# Altium schematic sheet Sheet4.SchDoc
size A; SheetNumber: 1; SheetTotal: 1
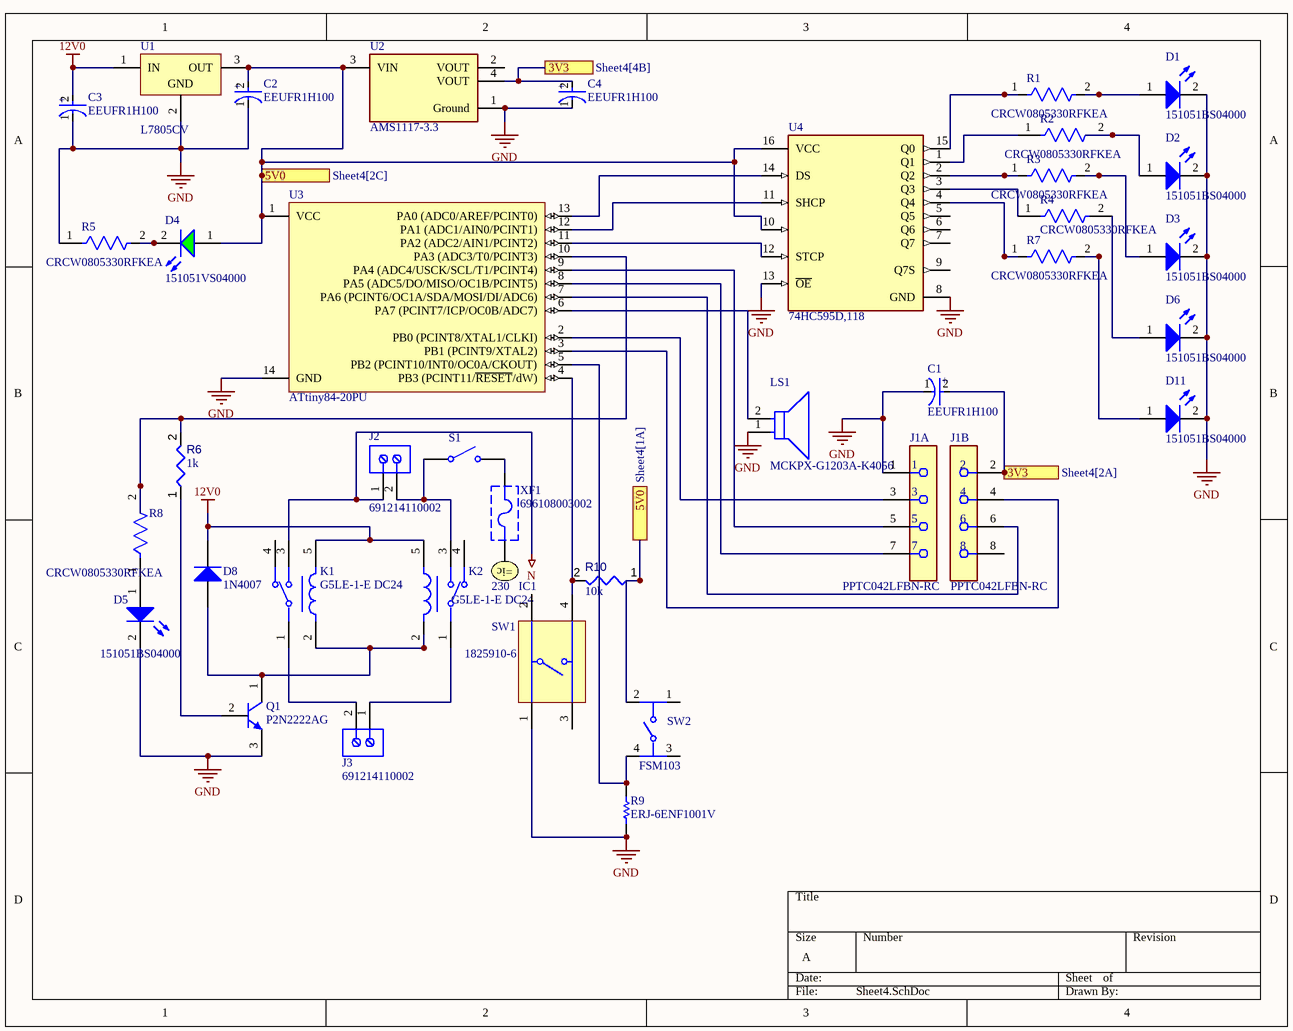
[diagram p0: Sheet4.SchDoc]

## Parts
C1  EEUFR1H100  [FP-RAD-TH-D_5_0_5-L_11_1-MFG]
C2  EEUFR1H100  [FP-RAD-TH-D_5_0_5-L_11_1-MFG]
C3  EEUFR1H100  [FP-RAD-TH-D_5_0_5-L_11_1-MFG]
C4  EEUFR1H100  [FP-RAD-TH-D_5_0_5-L_11_1-MFG]
D1  151051BS04000  [WL-TMRC_D5.9H8.7]
D2  151051BS04000  [WL-TMRC_D5.9H8.7]
D3  151051BS04000  [WL-TMRC_D5.9H8.7]
D4  151051VS04000  [WL-TMRC_D5.9H8.7]
D5  151051BS04000  [WL-TMRC_D5.9H8.7]
D6  151051BS04000  [WL-TMRC_D5.9H8.7]
D8  1N4007  [FAIR-DO-41-2]
D11  151051BS04000  [WL-TMRC_D5.9H8.7]
IC1  Initial Voltage: 230  (hidden comment: Initial Condition)
J1  PPTC042LFBN-RC  [FP-PPTC042LFBN-RC-MFG]  (parts A,B of 2)
J2  691214110002  [691214110002]
J3  691214110002  [691214110002]
K1  G5LE-1-E DC24  [FP-G5LE-1-E_DC24-MFG]
K2  G5LE-1-E DC24  [FP-G5LE-1-E_DC24-MFG]
LS1  MCKPX-G1203A-K4056  [FP-MCKPX-G1203A-K4056-MFG]
Q1  P2N2222AG  [ONSC-TO-92-3-29-11]
R1  CRCW0805330RFKEA  [FP-CRCW0805-e3-MFG]
R2  CRCW0805330RFKEA  [FP-CRCW0805-e3-MFG]
R3  CRCW0805330RFKEA  [FP-CRCW0805-e3-MFG]
R4  CRCW0805330RFKEA  [FP-CRCW0805-e3-MFG]
R5  CRCW0805330RFKEA  [FP-CRCW0805-e3-MFG]
R6  value 1k  [RESA60-630X240]  (hidden comment: MFR-25FBF52-47K5)
R7  CRCW0805330RFKEA  [FP-CRCW0805-e3-MFG]
R8  CRCW0805330RFKEA  [FP-CRCW0805-e3-MFG]
R9  ERJ-6ENF1001V  [RESC2013X70X40ML20T20]
R10  value 10k  [RESA60-630X240]  (hidden comment: MFR-25FBF52-47K5)
S1  Single-Pole, Single-Throw Switch  (value not drawn)
SW1  1825910-6  [TECO-1825910-6_V]
SW2  FSM103  [FP-FSM103-MFG]
U1  L7805CV  [TO220]
U2  AMS1117-3.3  [FP-AMS1117-IPC_C]
U3  ATtiny84-20PU  [14P3]
U4  74HC595D,118  [FP-SOT109-1-IPC_B]
XF1  696108003002  [696108003002]

## Ports
3V3 (see Sheet4[2A]), 3V3 (see Sheet4[4B]), 5V0 (see Sheet4[1A]), 5V0 (see Sheet4[2C])

## Nets
12V0: C3.2(A) D8.1(K) K1.5 K2.5 U1.1(IN)
GND: C1.1(C) C2.1(C) C3.1(C) C4.1(C) D1.2(K) D2.2(K) D3.2(K) D5.2(K) D6.2(K) D11.2(K) J1.1 LS1.1(C) Q1.3(E) R5.1 R9.1 SW1.1 U1.2(GND) U2.1(Ground) U3.14(GND) U4.8(GND) U4.13(~{OE})
N: J2.1 K1.3
3V3: C1.2(A) C4.2(A) J1.2 U2.4(VOUT) ; port 3V3
5V0: C2.2(A) D4.1(A) R10.1 SW2.2 U1.3(OUT) U2.3(VIN) U3.1(VCC) U4.10(~{MR}) U4.16(VCC) ; port 5V0
NetD1_1: D1.1(A) R1.2
NetD2_1: D2.1(A) R2.2
NetD3_1: D3.1(A) R3.2
NetD4_2: D4.2(K) R5.2
NetD5_1: D5.1(A) R8.1
NetD6_1: D6.1(A) R4.2
NetD8_2: D8.2(A) K1.2 K2.2 Q1.1(C)
NetD11_1: D11.1(A) R7.2
NetIC1_1: IC1.1 XF1.1
NetJ1_3: J1.3 U3.2(PB0_(PCINT8/XTAL1/CLKI))
NetJ1_4: J1.4 U3.3(PB1_(PCINT9/XTAL2))
NetJ1_5: J1.5 U3.9(PA4_(ADC4/USCK/SCL/T1/PCINT4))
NetJ1_6: J1.6 U3.7(PA6_(PCINT6/OC1A/SDA/MOSI/DI/ADC6))
NetJ1_7: J1.7 U3.8(PA5_(ADC5/DO/MISO/OC1B/PCINT5))
NetJ2_2: J2.2 K2.3 S1.1
NetJ3_1: J3.1 K2.1
NetJ3_2: J3.2 K1.1
NetLS1_2: LS1.2(A) U3.6(PA7_(PCINT7/ICP/OC0B/ADC7))
NetQ1_2: Q1.2(B) R6.1
NetR1_1: R1.1 U4.15(Q0)
NetR2_1: R2.1 U4.1(Q1)
NetR3_1: R3.1 U4.2(Q2)
NetR4_1: R4.1 U4.3(Q3)
NetR6_2: R6.2 R8.2 U3.10(PA3_(ADC3/T0/PCINT3))
NetR7_1: R7.1 U4.4(Q4)
NetR9_2: R9.2 SW2.4 U3.5(PB2_(PCINT10/INT0/OC0A/CKOUT))
NetR10_2: R10.2 SW1.4 U3.4(PB3_(PCINT11/~{RESET}/dW))
NetS1_2: S1.2 XF1.2
NetU3_11: U3.11(PA2_(ADC2/AIN1/PCINT2)) U4.12(STCP)
NetU3_12: U3.12(PA1_(ADC1/AIN0/PCINT1)) U4.11(SHCP)
NetU3_13: U3.13(PA0_(ADC0/AREF/PCINT0)) U4.14(DS)

Not connected (* = marked no-connect by the designer): J1 8; K1 4; K2 4; SW1 2 3; SW2 1 3; U2 2(VOUT); U4 5(Q5) 6(Q6) 7(Q7) 9(Q7S)

## Notes on the sheet
- (in symbol CMP-05427-001295-1) +

## Library data of the parts
C1-C4 = CMP-05427-001295-1: Aluminum Electrolytic Capacitors (Radial Lead Type) 10uF ±20% 50V; Lead Diameter: 0.5mm; Life (Hours): 5000Hour; Impedance: 340mR; Ripple Current (AC): 250mA; REACH SVHC: Yes; Tolerance: 20%; Construction: RADIAL; Min Operating Temperature: -40°C; Termination: Radial; Voltage Rating: 50V; Height: 11mm; Max Operating Temperature: 105°C; Capacitance: 10uF; Voltage: 50V; Diameter: 5mm; Lead Pitch: 2mm; Series: FR Radial; RoHS Compliant: Yes; Case/Package: Radial
D1-D3 D5 D6 D11 = CMP-1488-00009-2: NexarPartId: 29717812; Test Current: 20mA; Forward Voltage: 3.2V; Wavelength: 470nm; Lens Size: 5mm; Lens Style: Circular, Diffused, Round; Forward Current: 100mA; Peak Wavelength: 465nm; Viewing Angle: 40°; Luminous Intensity: 500mcd; Max Reverse Voltage (DC): 5V; Color: Blue; Case/Package: Radial; Width: 5mm; Mount: Through Hole; Min Operating Temperature: -40°C; Length: 5mm; Height: 8.6mm; Max Operating Temperature: 85°C; Packaging: Bulk; RoHS: Compliant; REACH SVHC: Unknown; Dominant Wavelength: 470nm
D4 = CMP-1488-00007-2: NexarPartId: 29717814; Forward Voltage: 2.1V; Viewing Angle: 40°; Lens Size: 5mm; Luminous Intensity: 140mcd; Color: Green; Max Reverse Voltage (DC): 5V; Wavelength: 572nm; Forward Current: 100mA; Peak Wavelength: 573nm; Test Current: 20mA; Lens Style: Circular, Diffused, Round; REACH SVHC: Unknown; Height: 8.6mm; Mount: Through Hole; Width: 5mm; Length: 5mm; Min Operating Temperature: -40°C; RoHS: Compliant; Dominant Wavelength: 572nm; Case/Package: Radial; Max Operating Temperature: 85°C; Packaging: Bulk
D8 = CMP-004-00007-2: General Purpose Rectifier, 1.1 V, 1.0 A, -55 to 175 degC, 2-Pin DO-41, RoHS, Tape and Reel; Manufacturer: Fairchild; Peak Reverse Current: 5uA; Max Surge Current: 30A; Elements: 1; Forward Voltage: 1.1V; Package Version: Rev. 2, 09/2008; Forward Current: 1A; Package Quantity: 5000; Packaging: TapeandReel; Package URL: http://www.fairchildsemi.com/dwg/DO/DO41A.pdf; Manufacturer URL: https://www.fairchildsemi.com/; Package Reference: DO-41-2; Pins: 2; Min Operating Temperature: -55°C; Datasheet Version: Rev. 1.1.0, 11/2014; Max Operating Temperature: 175°C; RoHS Compliant: True; Case/Package: DO-41-2; Mounting Technology: TH; Package Description: 2-Pin Axial Lead, Dia 2.375 mm, Body Length 4.63 mm; Datasheet URL: https://www.fairchildsemi.com/datasheets/1N/1N4007.pdf
IC1 = .IC: SimulationGenericComponent: True
J1 = CMP-25680-000004-1: CONN HDR 8POS 0.1 TIN PCB; Manufacturer: Sullins; Is Female: yes; Conn Orientation: Straight; Conn Gender: Female; Number Of Contacts: 8; Pitch: 2.54mm; Voltage Rating: 250V; Current Rating: 3A; Package: PPTC042LFBN-RC; Number Of Rows: 2; Manufacturer Part Number: PPTC042LFBN-RC; Contact Material: Tin,Nickel; Temperature: -40°C to +105°C; Height: 8.65mm; Device Class L2: Headers and Wire Housings; Octopart: https://octopart.com/pptc042lfbn-rc-sullins-271088; RoHS: TRUE; ComponentLink2URL: https://drawings-pdf.s3.amazonaws.com/10492.pdf; Lead Free: Yes; Automotive: No; Device Class L3: unset; ComponentLink2Description: Datasheet; Temperature Range High: +105°C; Digikey Description: CONN HDR 8POS 0.1 TIN PCB; Category: Conn; Device Class L1: Connectors; Temperature Range Low: -40°C
J2 J3 = CMP-1502-02464-2: NexarPartId: 18818288; Plating: Brass, Steel; Current: 10A; Pitch: 3.5052mm; Number of Levels: 1; Number of Contacts: 2; Wire Gauge (Min): 16AWG; Voltage: 300V; Wire Gauge (Max): 24AWG; Stripping Length: -6mm; Number of Pins: 2; Number of Rows: 1; REACH SVHC: Unknown; RoHS: Compliant; Housing Material: Nylon; Termination: Screw; Mount: Through Hole; Contact Plating: Brass, Tin; Number of Positions Per Level: 2; Color: Blue, Green; Width: 7.9mm; Voltage Rating: 300V; Length: 7.4mm; Current Rating: 10A; Wire/Cable Gauge: 24AWG; Packaging: Box; Max Operating Temperature: 105°C; Lead Pitch: 3.5mm; Height: 8.7mm; Contact Material: Brass; Min Operating Temperature: -40°C
K1 K2 = CMP-08822-000256-1: RELAY GEN PURPOSE SPDT 16A 24V; Release Time: 5ms; Application(s): POWER; Coil Resistance: 1.44kR; Power Consumption: 400mW; Max Voltage Rating (AC): 250V; Coil Current: 16.7mA; Life (Hours): 1000000Hour; Operate Time: 10ms; Coil Type: Non-Latching; Relay Type: General Purpose; Max Operating Temperature: 85°C; Radiation Hardening: No; Package Quantity: 500; Packaging: Tray; Lead Free: Lead Free; Depth: 16.5mm; Throw Configuration: SPDT; Contact Current Rating: 16A; Mount: Through Hole; Termination: PC Pin; Min Operating Temperature: -40°C; Height: 19mm; Coil Power: 400mW; Contact Material: Tin; Series: G5LE-E; Length: 22.5mm; Width: 16.5mm; Coil Voltage (DC): 24V; Max Current Rating: 16A; Number of Pins: 5
LS1 = CMP-12433-000001-1: MAGNETIC BUZZER AND TRANSDUCER - More Details; Manufacturer: Multicomp Pro; Operating Supply Voltage: 3V; Current: 30mA; Frequency: 2300Hz; Max Supply Voltage: 5V; Min Supply Voltage: 2V; Standoff Height: 0.5mm; ComponentLink2Description: Datasheet; ComponentLink2URL: http://www.farnell.com/datasheets/1498149.pdf?_ga=2.17855225.1157923166.1572356775-536200964.1569240579; Manufacturer Part Number: MCKPX-G1203A-K4056; Temperature Range High: +70°C; Device Class L2: Audio Products; Temperature Range Low: -20°C; Package: 0; Temperature: -20°C to +70°C; Category: Speak; Octopart: https://octopart.com/mckpx-g1203a-k4056-multicomp-12157154; RoHS: TRUE; Lead Free: Yes; Height: 9.5mm; Device Class L1: Electromechanical; Automotive: No; Device Class L3: Buzzers
Q1 = CMP-1048-01402-1: Amplifier Transistor, NPN Silicon, 3-Pin TO-92, Pb-Free, Bulk Box; Manufacturer: On Semiconductor; IC Continuous (A): 0.6; fT Min (MHz): 300; ComponentLink2Description: Datasheet; ComponentLink1Description: Manufacturer URL; ComponentLink2URL: http://www.onsemi.com/pub_link/Collateral/P2N2222A-D.PDF; ComponentLink3Description: Package Specification; RoHS: TRUE; ComponentLink1URL: http://www.onsemi.com/; PartNumber: P2N2222AG; Mounting Technology: Through Hole; PackageReference: TO-92-3-29-11_AM_SL; Polarity: NPN; Packing: Bulk Box; DatasheetVersion: Rev. 7; PackageDescription: 3-Pin Transistor Outline, Body 4.825 x 3.685 mm, Pitch 1.27 mm; PackageVersion: Rev. AM; ComponentLink3URL: http://www.onsemi.cn/pub_link/Collateral/2N6426-D.PDF
R1-R5 R7 R8 = CMP-2001-03823-2: RES Thick Film, 330Ω, 1%, 0.125W, 100ppm/°C, 0805; Voltage Rating (DC): 150V; Resistance: 330R; Max Power Dissipation: 125mW; Mount: Surface Mount; Packaging: Tape and Reel; Min Operating Temperature: -55°C; Military Standard: Not; Case Code (Metric): 2012; Height: 0.02inch; Voltage Rating: 150V; Case/Package: 0805; Max Operating Temperature: 155°C; Width: 0.049inch; Case Code (Imperial): 0805; Termination: SMD/SMT; Lead Free: Lead Free; Contact Plating: Tin; Package Quantity: 10; Composition: Thick Film; Length: 2mm; Features: Automotive AEC-Q200; Depth: 1.25mm; Weight: 0.000194oz; Tolerance: 1%; Power Rating: 125mW; Number of Terminations: 2; Temperature Coefficient: 100ppm/°C
R6 R10 = CMP-009-00057-4: Axial Resistor, 47.5 KOhm, +/- 1%, 0.25 W, -55 to 155 degC, 2-Pin THD, RoHS, Bulk; Manufacturer: Yageo; Voltage Rating: 250V; Power: 250mW; RoHS Compliant: True; Packaging: Bulk; Manufacturer URL: http://www.yageo.com/; Package Quantity: 200; Datasheet URL: http://www.yageo.com/documents/recent/Yageo%20LR_MFR_2013.pdf; Case/Package: Axial; Package Reference: MFR-25; Tolerance: 1%; Max Operating Temperature: 155°C; Package Description: 2-Pin Axial Lead, Dia 2.4 mm, Body Length 6.3 mm; Datasheet Version: Apr-13; Min Operating Temperature: -55°C; Mounting Technology: TH
R9 = CMP-2001-04375-5: Chip Resistor, 1 KOhm, +/- 1%, 0.125 W, -55 to 155 degC, 0805 (2012 Metric), RoHS, Tape and Reel; Manufacturer: Panasonic; Voltage Rating: 150 V; ComponentLink1URL: http://www.panasonic.com/; ComponentLink2Description: Datasheet; REACH SVHC: Yes; ComponentLink1Description: Manufacturer URL; Length: 2 mm; Height: 0.6 mm; Package Quantity: 1; PackageDescription: 2-Pin Surface Mount Device, Body 2 x 1.25 mm; Packaging: Cut Tape; PackageReference: 0805; Max Operating Temperature: 155 degC; Mounting Technology: Surface Mount; ComponentLink2URL: http://industrial.panasonic.com/cdbs/www-data/pdf/RDA0000/AOA0000C86.pdf; DatasheetVersion: 04/2015; Min Operating Temperature: -55 degC; RoHSCompliant: true; Mount: Surface Mount
S1 = SPST SW: closed: 0; Rclosed: 1m; Ropen: 1Meg; SimulationGenericComponent: True
SW1 = CMP-1684-00021-1: Tact Switch, SPST-NO, 0.05 A, -35 to 85 degC, 4-Pin THD, RoHS, Bulk; Manufacturer: TE Connectivity; Maximum Contact Resistance: 100mOhm; Mechanical Life: 100000Cycles; Bushing Type: Unthreaded; Switch Configuration: OFF(ON); Maximum DC Voltage Rating: 24V; Contact Rating @ Voltage: 0.05A@24VDC; Actuator Color: Black; Body Orientation: Straight; Function: MomentaryContact; Illumination: N/R; Actuator Style: RoundButton; Actuator Material: PolybutyleneTerephthalate; Dielectric Strength: 500VAC; Pole Throw Configuration: SPST; Actuator Length: 1.4mm; Product Weight: N/A; Contact Material: CopperAlloy; Housing Material: N/A; Terminal Type: PCPins; Minimum Insulation Resistance: 100MOhm; Package Description: 4-Pin Through Hole Device, Body 5.99 x 5.99 mm, Pitch 6.5 mm; Part No: 1825910-6; Package Reference: THD; Base Material: N/A; Manufacturer URL: http://www.te.com; Contact Plating: Silver; RoHS: Yes; Datasheet Version: Rev. C9; Electrical Life: 100000Cycles; Maximum AC Voltage Rating: N/A; Thread Size: N/R; Operating Temperature: -35to85C; Mounting: ThroughHole; Dimension: 5.99x5mm; Datasheet URL: http://www.te.com/commerce/DocumentDelivery/DDEController?Action=showdoc&DocId=Customer+Drawing%7F1825910%7FC9%7Fpdf%7FEnglish%7FENG_CD_1825910_C9.pdf%7F1825910-6; Family: 1825910; Seal Location: N/A; Seal Description: N/A; Packaging: N/A
SW2 = CMP-03407-000037-1: SWITCH TACTILE SPST-NO 0.05A 24V; Contact Resistance: 100mR; Actuator Length: 3.4mm; Switch Function: Off-Mom; Operating Force: 1.57N; Illumination Type: Non-Illuminated; Voltage Rating (DC): 12V; Current Rating: 50mA; Actuator Material: Polyester; Switch Travel: 0.3mm; Throw Configuration: SPST; Actuator Color: Black; Mechanical Life: 100000Cycles; Depth: 14.1mm; RoHS Compliant: Yes; Max Operating Temperature: 85°C; Mount: Through Hole; Min Operating Temperature: -35°C; Contact Plating: Silver; Width: 12mm; Package Quantity: 400; Radiation Hardening: No; Series: FSM100 ~ 104; Type: Switch; Termination: PC Pins; Voltage Rating: 24V; Contact Material: Brass; Max Voltage Rating (DC): 12V; Contact Current Rating: 50mA; Length: 12mm; Packaging: Loose Piece; Orientation: Straight; Max Current Rating: 50mA; Electrical Life: 100000Cycles
U1 = CMP-0244-00483-1: Positive Voltage Regulator, 5V, 3-Pin TO-220; PackageDescription: TO, Thru-Hole, Vertical, Heatsink Mounted; 3 In-Line Leads; Pitch 2.54 mm; ComponentLink2Description: Datasheet; PackageReference: TO220; ComponentLink3URL: http://www.st.com/internet/com/TECHNICAL_RESOURCES/TECHNICAL_LITERATURE/PACKAGE_INFORMATION/CD00004649.pdf; DatasheetVersion: 16/11/2011; ComponentLink1Description: Manufacturer URL; ComponentLink1URL: http://www.st.com; PackageVersion: ver3.0; ComponentLink3Description: Package Specification; ComponentLink2URL: http://www.st.com/internet/com/TECHNICAL_RESOURCES/TECHNICAL_LITERATURE/DATASHEET/CD00000444.pdf
U2 = CMP-209535-000001-1: LDO Voltage Regulators 1A, 3.3V; Manufacturer: Advanced Monolithic Systems; Dropout Voltage: 1.1V; Output Type: Fixed; Nominal Supply Current: 5mA; Max Power Dissipation: 1.2W; Max Supply Voltage: 15V; Number Of Outputs: 1; Standoff Height: 0.64mm; Max Junction Temp: +125°C; Height: 1.8mm; Package: AMS1117; Device Class L2: Power Management ICs; ComponentLink2Description: Datasheet; ComponentLink2URL: http://www.advanced-monolithic.com/pdf/ds1117.pdf; Category: IC; RoHS: TRUE; Automotive: No; Device Class L1: Integrated Circuits (ICs); Output Current: 1A; Device Class L3: Voltage Regulators - Linear; Temperature: -40°C to +125°C; Output Voltage: 3.3V; Manufacturer Part Number: AMS1117-3.3; Temperature Range Low: -40°C; Octopart: https://octopart.com/ams1117-3.3-advanced+monolithic+systems-25899300; Lead Free: Yes; Ipc Land Pattern Name: SOT229P700X180-4; Temperature Range High: +125°C
U3 = CMP-0093-00026-2: 8-bit AVR Microcontroller, 20MHz, 2.7-5.5V, 8KB Flash, 512 Bytes EEPROM, 512 Bytes SRAM, 14-pin PDIP, Industrial Grade (-40°C to 85°C), Pb-Free; PackageDescription: 14-Lead Plastic Dual In-Line, 300 mil/7.62 mm Wide Body (PDIP); Code_JEDEC: MS-001-AA; ComponentLink3Description: ATtiny24/44/84 Summary; ComponentLink2URL: http://www.atmel.com/dyn/resources/prod_documents/doc8006.pdf; ComponentLink1Description: Manufacturer URL; RevisionNote: DatasheetVersion updated. URLs added.; ComponentLink3URL: http://www.atmel.com/dyn/resources/prod_documents/8006S.pdf; PackageReference: 14P3; ComponentLink2Description: ATtiny24/44/84 Datasheet; PackageVersion: revB, Oct-2010; ComponentLink1URL: http://www.atmel.com/; DatasheetVersion: revK, Oct-2010
U4 = CMP-14351-000006-1: IC SHIFT REGISTER 8BIT 16SOIC; RoHS Compliant: Yes
XF1 = CMP-1502-00237-2: NexarPartId: 56808807; Voltage Rating (AC): 250V; Fuse Current: 10A; REACH SVHC: Unknown; RoHS: Non-Compliant; Mount: Through Hole; Packaging: Box